# EAGLE schematic kinesisBLE V4 (EAGLE 9.1.3)
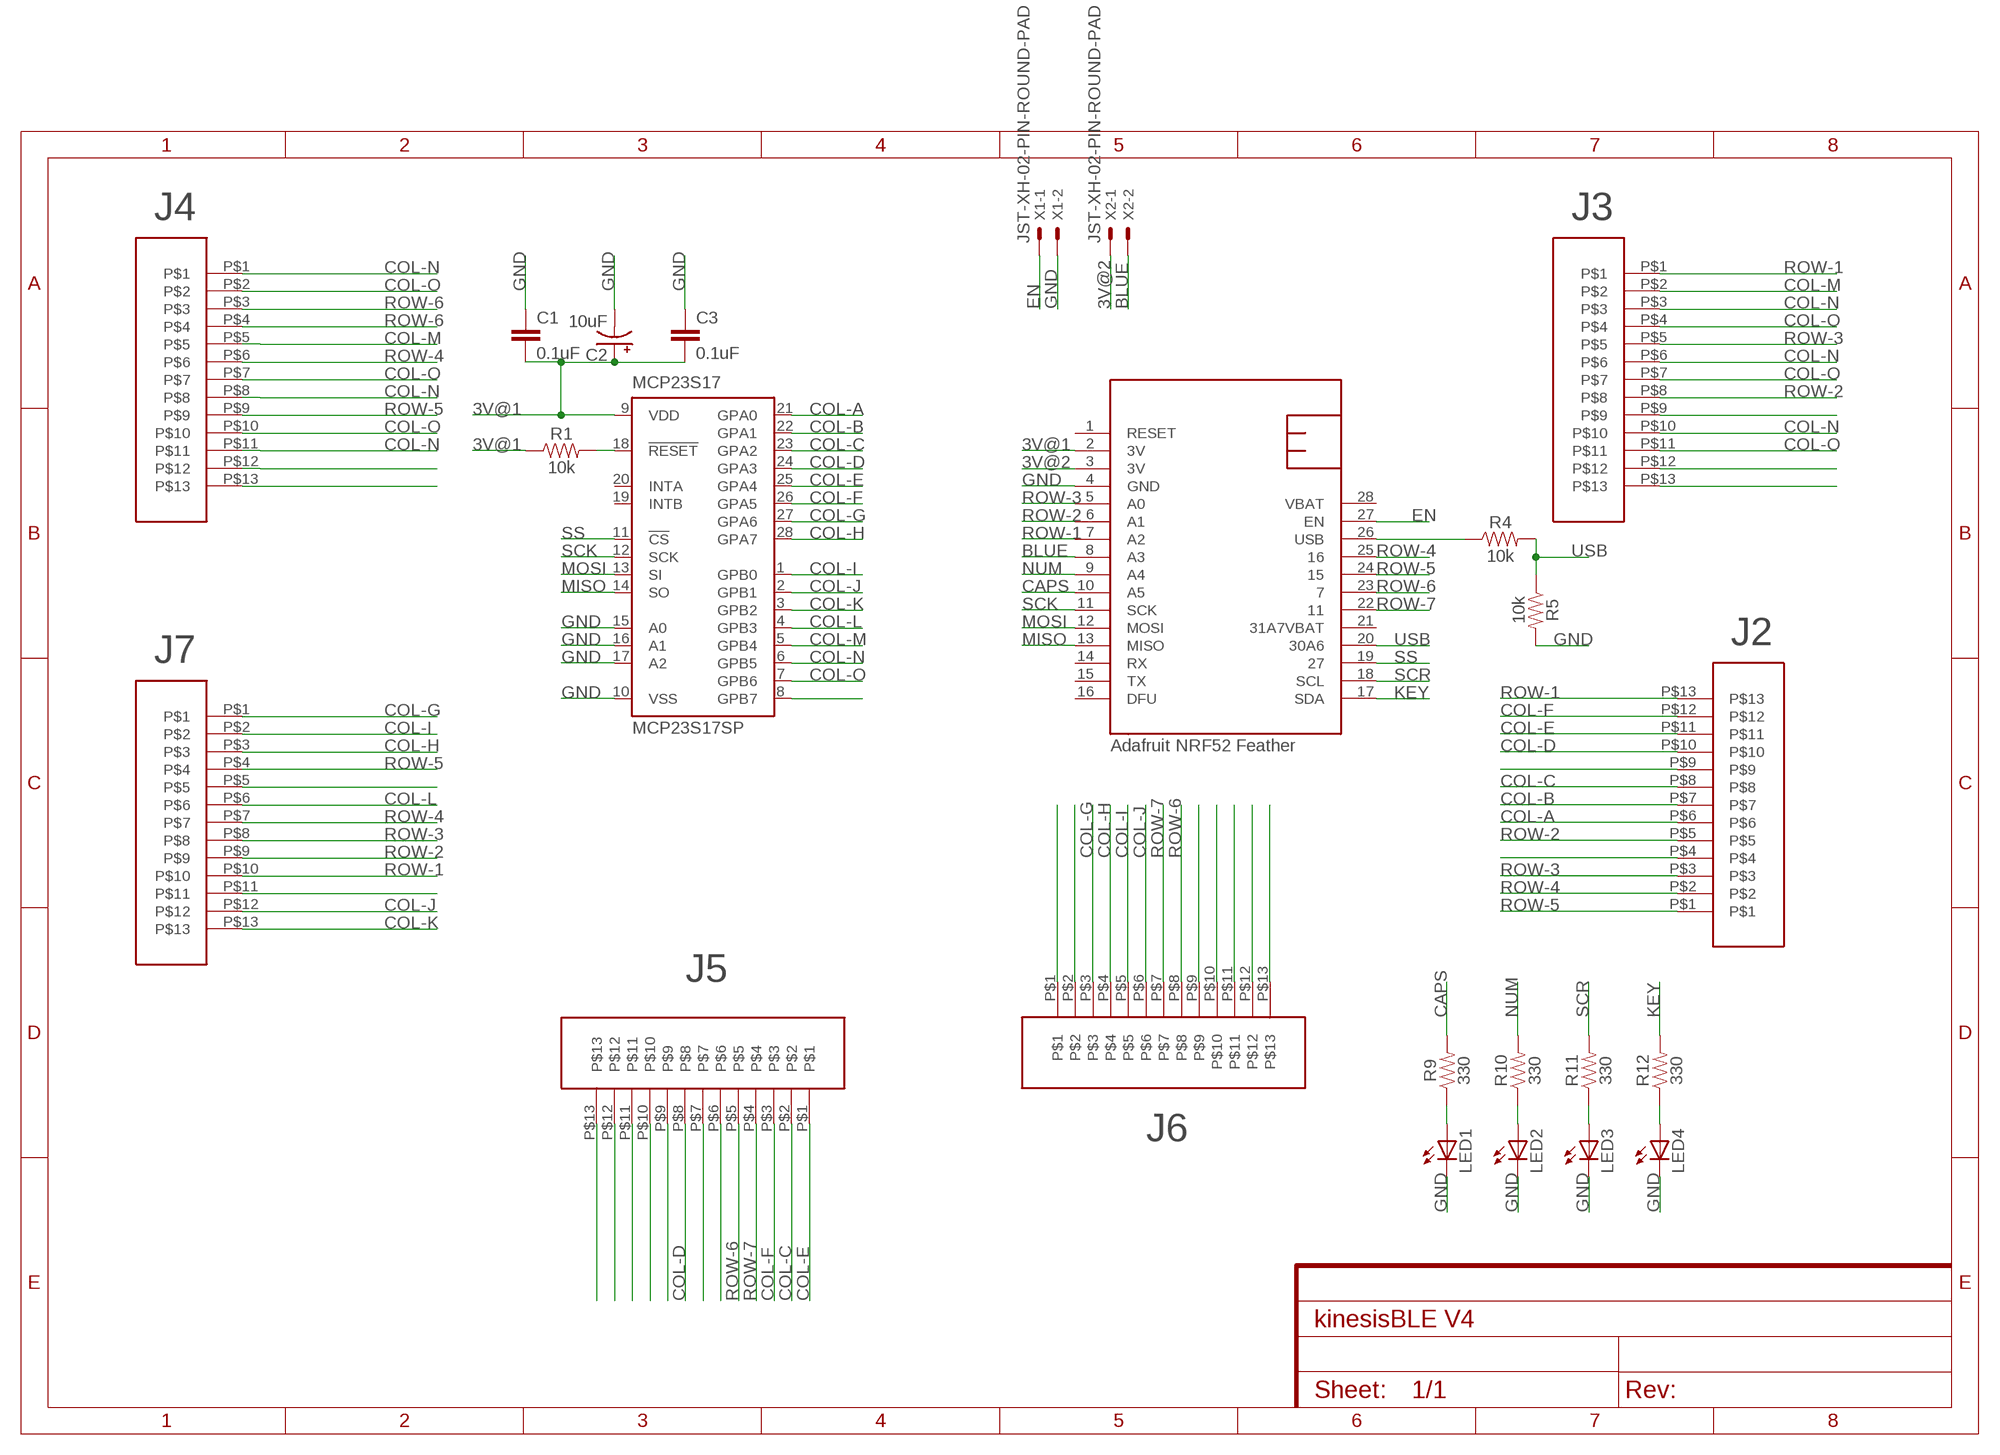
[diagram p0: schematic, sheet 1]

## Parts
C1  0.1uF  0.1UF-KIT-EZ-50V-20%  [CAP-PTH-SMALL-KIT]
C2  10uF  10UF-POLAR-RADIAL-2.5MM-25V-20%  [CPOL-RADIAL-2.5MM-5MM]
C3  0.1uF  0.1UF-KIT-EZ-50V-20%  [CAP-PTH-SMALL-KIT]
LED1  LED3MM  [LED3MM]
LED2  LED3MM  [LED3MM]
LED3  LED3MM  [LED3MM]
LED4  LED3MM  [LED3MM]
MCP23S17  MCP23S17SP  [DIL28-3]
R1  10k  10KOHM-HORIZ-1/4W-5%  [AXIAL-0.3]
R4  10k  10KOHM-HORIZ-1/4W-5%  [AXIAL-0.3]
R5  10k  10KOHM-HORIZ-1/4W-5%  [AXIAL-0.3]
R9  330  330OHM-HORIZ-1/10W-5%  [AXIAL-0.3]
R10  330  330OHM-HORIZ-1/10W-5%  [AXIAL-0.3]
R11  330  330OHM-HORIZ-1/10W-5%  [AXIAL-0.3]
R12  330  330OHM-HORIZ-1/10W-5%  [AXIAL-0.3]
U$1  NRF52FEATHER  [NRF52FEATHER]
U$2  TOPLINKS_STAPELBERG  [TOPLINKS_STAPELBERG]
U$3  TOPLINKS_STAPELBERG  [TOPLINKS_STAPELBERG]
U$4  TOPLINKS_STAPELBERG  [TOPLINKS_STAPELBERG]
U$5  TOPLINKS_STAPELBERG  [TOPLINKS_STAPELBERG]
U$6  TOPLINKS_STAPELBERG  [TOPLINKS_STAPELBERG]
U$7  TOPLINKS_STAPELBERG  [TOPLINKS_STAPELBERG]
X1  JST-XH-02-PIN-ROUND-PAD  [JST-XH-02-PACKAGE-ROUND-PAD]
X2  JST-XH-02-PIN-ROUND-PAD  [JST-XH-02-PACKAGE-ROUND-PAD]

## Nets
3V@1: C1.2 C2.1(+) C3.2 MCP23S17.9(VDD) R1.P$1 U$1.2(3V)
3V@2: U$1.3(3V) X2.1
BLUE: U$1.8(A3) X2.2
CAPS: R9.P$2 U$1.10(A5)
COL-A: MCP23S17.21(GPA0) U$5.P$6
COL-B: MCP23S17.22(GPA1) U$5.P$7
COL-C: MCP23S17.23(GPA2) U$5.P$8 U$6.P$2
COL-D: MCP23S17.24(GPA3) U$5.P$10 U$6.P$8
COL-E: MCP23S17.25(GPA4) U$5.P$11 U$6.P$1
COL-F: MCP23S17.26(GPA5) U$5.P$12 U$6.P$3
COL-G: MCP23S17.27(GPA6) U$4.P$1 U$7.P$3
COL-H: MCP23S17.28(GPA7) U$4.P$3 U$7.P$4
COL-I: MCP23S17.1(GPB0) U$4.P$2 U$7.P$5
COL-J: MCP23S17.2(GPB1) U$4.P$12 U$7.P$6
COL-K: MCP23S17.3(GPB2) U$4.P$13
COL-L: MCP23S17.4(GPB3) U$4.P$6
COL-M: MCP23S17.5(GPB4) U$2.P$5 U$3.P$2
COL-N: MCP23S17.6(GPB5) U$2.P$1 U$2.P$8 U$2.P$11 U$3.P$3 U$3.P$6 U$3.P$10
COL-O: MCP23S17.7(GPB6) U$2.P$2 U$2.P$7 U$2.P$10 U$3.P$4 U$3.P$7 U$3.P$11
EN: U$1.27(EN) X1.1
GND: C1.1 C2.2(-) C3.1 LED1.K(C) LED2.K(C) LED3.K(C) LED4.K(C) MCP23S17.10(VSS) MCP23S17.15(A0) MCP23S17.16(A1) MCP23S17.17(A2) R5.P$2 U$1.4(GND) X1.2
KEY: R12.P$2 U$1.17(SDA)
MISO: MCP23S17.14(SO) U$1.13(MISO)
MOSI: MCP23S17.13(SI) U$1.12(MOSI)
N$1: LED1.A R9.P$1
N$2: U$3.P$13
N$3: U$3.P$12
N$4: MCP23S17.18(!RESET) R1.P$2
N$5: R4.P$1 U$1.26(USB)
N$6: U$3.P$9
N$10: LED2.A R10.P$1
N$11: LED3.A R11.P$1
N$12: LED4.A R12.P$1
N$19: U$5.P$9
N$21: MCP23S17.8(GPB7)
N$24: U$5.P$4
N$39: U$2.P$12
N$40: U$2.P$13
N$44: U$4.P$5
N$50: U$4.P$11
N$54: U$6.P$13
N$55: U$6.P$11
N$56: U$6.P$12
N$57: U$6.P$10
N$58: U$6.P$9
N$60: U$6.P$7
N$61: U$6.P$6
N$67: U$7.P$1
N$68: U$7.P$2
N$75: U$7.P$9
N$76: U$7.P$10
N$77: U$7.P$11
N$78: U$7.P$12
N$79: U$7.P$13
NUM: R10.P$2 U$1.9(A4)
ROW-1: U$1.7(A2) U$3.P$1 U$4.P$10 U$5.P$13
ROW-2: U$1.6(A1) U$3.P$8 U$4.P$9 U$5.P$5
ROW-3: U$1.5(A0) U$3.P$5 U$4.P$8 U$5.P$3
ROW-4: U$1.25 U$2.P$6 U$4.P$7 U$5.P$2
ROW-5: U$1.24 U$2.P$9 U$4.P$4 U$5.P$1
ROW-6: U$1.23 U$2.P$3 U$2.P$4 U$6.P$5 U$7.P$8
ROW-7: U$1.22 U$6.P$4 U$7.P$7
SCK: MCP23S17.12(SCK) U$1.11(SCK)
SCR: R11.P$2 U$1.18(SCL)
SS: MCP23S17.11(!CS) U$1.19
USB: R4.P$2 R5.P$1 U$1.20(30A6)
Unconnected: MCP23S17.19(INTB) MCP23S17.20(INTA) U$1.1(RESET) U$1.14(RX) U$1.15(TX) U$1.16(DFU) U$1.21(31A7VBAT)

## Notes on the sheet
- J4 | J3
- J2
- J7
- Adafruit NRF52 Feather
- J5
- J6

## Power pins joined to a net without a drawn wire
VBAT: U$1.28(VBAT)

## Library data of the parts
C1 C3 = SparkFun-Capacitors:0.1UF: 0.1µF ceramic capacitors A capacitor is a passive two-terminal electrical component used to store electrical energy temporarily in an electric field.; PROD_ID: CAP-08370
C2 = SparkFun-Capacitors:10UF-POLAR: 10.0µF polarized capacitors A capacitor is a passive two-terminal electrical component used to store electrical energy temporarily in an electric field.; PROD_ID: CAP-08440
LED1-LED4 = adafruit:LED: LED OSRAM: - CHIPLED LG R971, LG N971, LY N971, LG Q971, LY Q971, LO R971, LY R971 LH N974, LH R974 LS Q976, LO Q976, LY Q976 LO Q996 - Hyper CHIPLED LW Q18S LB Q993, LB Q99A, LB R99A - SideLED LS A670, LO A670, LY A670, LG A670, LP A670 LB A673, LV A673, LT A673, LW A673 LH A674 LY A675 LS A676, LA A676, LO A676, LY A676, LW A676 LS A679, LY A679, LG A679 - Hyper Micro SIDELED® LS Y876, LA Y876, LO Y876, LY Y876 LT Y87S - SmartLED LW L88C, LW L88S LB L89C, LB L89S, LG L890 LS L89K, LO L89K, LY L89K LS L896, LA L896, LO L896, LY L896 - TOPLED LS T670, LO T670, LY T670, LG T670, LP T670 LSG T670, LSP T670, LSY T670, LOP T670, LYG T670 LG T671, LOG T671, LSG T671 LB T673, LV T673, LT T673, LW T673 LH T674 LS T676, LA T676, LO T676, LY T676, LB T676, LH T676, LSB T676, LW T676 LB T67C, LV T67C, LT T67C, LS T67K, LO T67K, LY T67K, LW E67C LS E67B, LA E67B, LO E67B, LY E67B, LB E67C, LV E67C, LT E67C LW T67C LS T679, LY T679, LG T679 LS T770, LO T770, LY T770, LG T770, LP T770 LB T773, LV T773, LT T773, LW T773 LH T774 LS E675, LA E675, LY E675, LS T675 LS T776, LA T776, LO T776, LY T776, LB T776 LHGB T686 LT T68C, LB T68C - Hyper Mini TOPLED® LB M676 - Mini TOPLED Santana® LG M470 LS M47K, LO M47K, LY M47K Source: http://www.osram.convergy.de/
MCP23S17 = microchip:MCP23S17: http://ww1.microchip.com/downloads/en/DeviceDoc/21952a.pdf Source: http://ww1.microchip.com/downloads/en/DeviceDoc/21952a.pdf; MF: MICROCHIP; MPN: MCP23S17-E/SP; OC_FARNELL: 1292238; OC_NEWARK: 31K2951
R1 R4 R5 = SparkFun-Resistors:10KOHM: 10kΩ resistor A resistor is a passive two-terminal electrical component that implements electrical resistance as a circuit element. Resistors act to reduce current flow, and, at the same time, act to lower voltage levels within circuits. - Wikipedia; PROD_ID: RES-09435
R9-R12 = SparkFun-Resistors:330OHM: 330Ω resistor A resistor is a passive two-terminal electrical component that implements electrical resistance as a circuit element. Resistors act to reduce current flow, and, at the same time, act to lower voltage levels within circuits. - Wikipedia; PROD_ID: RES-8371
U$1 = mike:NRF52FEATHER
U$2-U$7 = con-molex-39-53:TOPLINKS_STAPELBERG
X1 X2 = Rembrandt Electronics - JST XH Connectors v1-0:JST-XH-02-PIN: JST XH Connector 2 Pin Wire to board connector. Pitch: 2,54 mm, (0.100") Number of pins: 2 Created by Rembrandt Electronics www.rembrandtelectronics.com